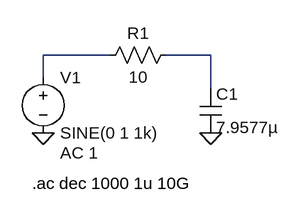
[diagram p0: schematic lpf.asc]
lpf.asc, the LTspice schematic file:
Version 4
SHEET 1 880 680
WIRE 304 48 208 48
WIRE 448 48 384 48
WIRE 208 80 208 48
WIRE 448 96 448 48
FLAG 208 160 0
FLAG 448 160 0
SYMBOL voltage 208 64 R0
WINDOW 123 24 124 Left 2
WINDOW 39 0 0 Left 0
SYMATTR Value2 AC 1
SYMATTR InstName V1
SYMATTR Value SINE(0 1 1k)
SYMBOL res 400 32 R90
WINDOW 0 0 56 VBottom 2
WINDOW 3 32 56 VTop 2
SYMATTR InstName R1
SYMATTR Value 10
SYMBOL cap 432 96 R0
SYMATTR InstName C1
SYMATTR Value 7.9577µ
TEXT 192 232 Left 2 !.ac dec 1000 1u 10G

The netlist it stands for:
* lpf.asc
V1 N001 0 SINE(0 1 1k) AC 1
R1 N002 N001 10
C1 N002 0 7.9577µ
.ac dec 1000 1u 10G
.backanno
.end